# EAGLE design d11toy2ccc (EAGLE 6.6.0)
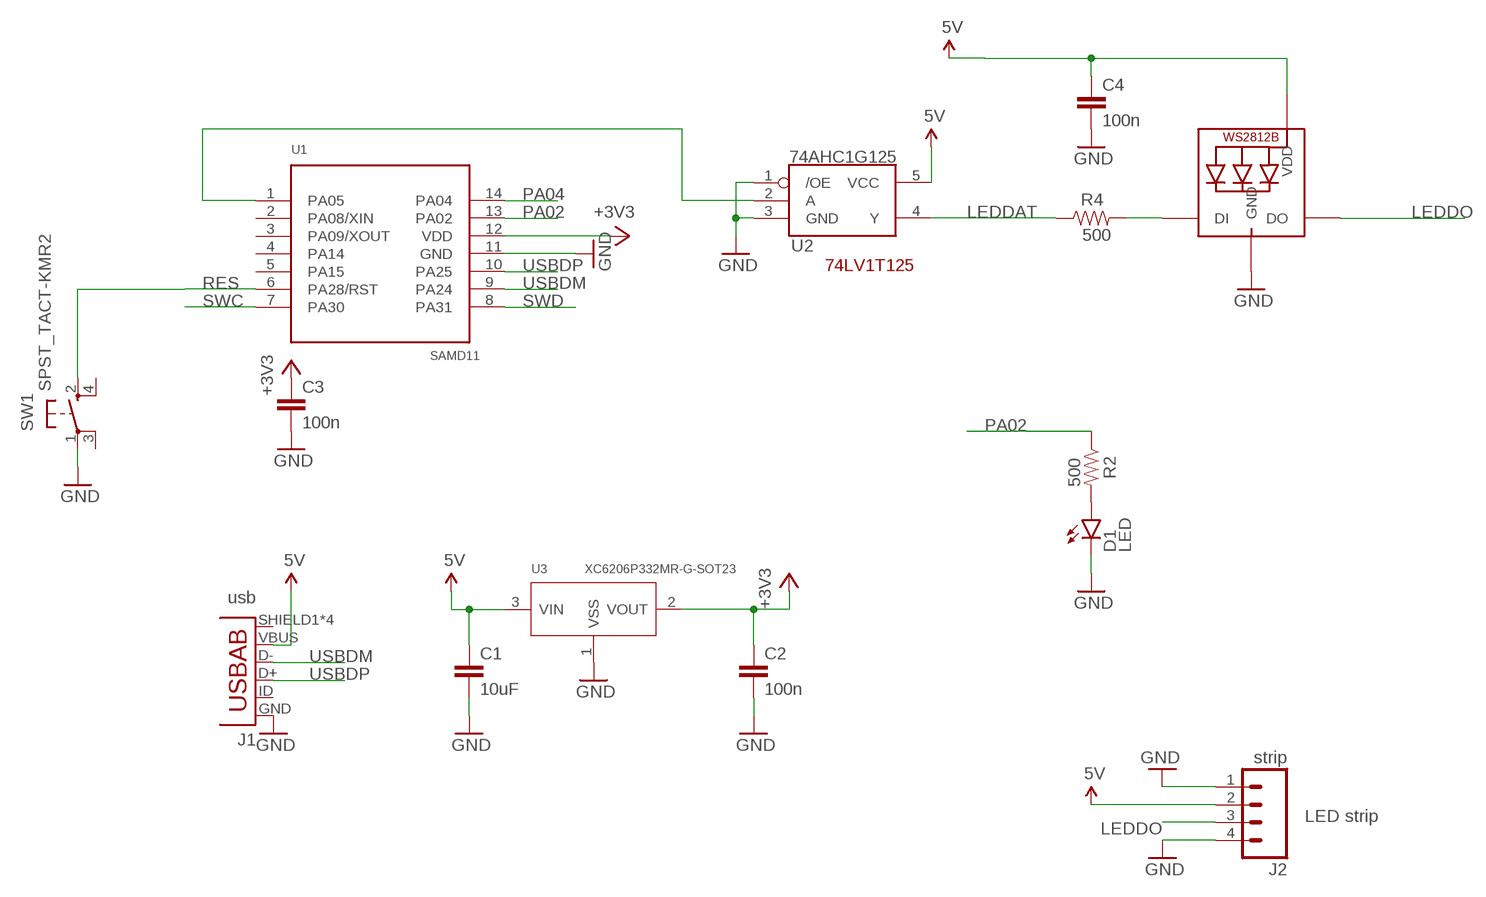
[diagram p0: schematic, sheet 1]

## Parts
C1  10uF  CAP0603-CAP  [0603-CAP]
C2  100n  CAP0603-CAP  [0603-CAP]
C3  100n  CAP0603-CAP  [0603-CAP]
C4  100n  CAP0603-CAP  [0603-CAP]
D1  LED  LED0603  [LED-0603]
J1  usb  USB-AB  [USB-AB-MICRO-SMD]
J2  strip  M04NO_SILK_ALL_ROUND  [1X04_NO_SILK_ALL_ROUND]
LED1  WS2812B5050  [WS2812B]
R2  500  RESISTOR0603-RES  [0603-RES]
R4  500  RESISTOR0603-RES  [0603-RES]
SW1  SPST_TACT-KMR2  [KMR2]
U1  SAMD11  SAMD11C14  [SO14]
U2  74AHC1G125  [SOT23-5]
U3  XC6206P332MR-G-SOT23  PMIC-LDO-XC6206P332MR-G(SOT23)  [SOT-23]

## Nets
5V: C1.1 C4.1 J1.VBUS J2.2 LED1.1-VDD(VDD) U2.5(VCC) U3.3(VIN)
+3V3: C2.1 C3.1 U1.12(VDD) U3.2(VOUT)
GND: C1.2 C2.2 C3.2 C4.2 D1.C J1.GND J2.1 J2.4 LED1.3-GND(GND) SW1.1(P) U1.11(GND) U2.1(/OE) U2.3(GND) U3.1(VSS)
LEDDAT: R4.1 U2.4(Y)
LEDDAT3V3: U1.1(PA05) U2.2(A)
LEDDO: J2.3 LED1.2-DOUT(DO)
N$1: D1.A R2.2
N$5: LED1.4-DIN(DI) R4.2
PA02: R2.1 U1.13(PA02)
PA04: U1.14(PA04)
RES: SW1.2(S) U1.6(PA28/RST)
SWC: U1.7(PA30)
SWD: U1.8(PA31)
USBDM: J1.D- U1.9(PA24)
USBDP: J1.D+ U1.10(PA25)
Unconnected: J1.ID(USBID) J1.SHIELD1(SHIELD) J1.SHIELD2(SHIELD) J1.SHIELD3(SHIELD) J1.SHIELD4(SHIELD) SW1.3(P1) SW1.4(S1) U1.2(PA08/XIN) U1.3(PA09/XOUT) U1.4(PA14) U1.5(PA15)

## Notes on the sheet
- 74LV1T125
- LED strip

## Library data of the parts
C1-C4 = SparkFun-Capacitors:CAP: Capacitor Standard 0603 ceramic capacitor, and 0.1" leaded capacitor.
D1 = SparkFun-LED:LED: LEDs Standard schematic elements and footprints for 5mm, 3mm, 1206, and 0603 sized LEDs. 5mm - Spark Fun Electronics SKU : COM-00529 (and others)
J1 = SparkFun-Connectors:USB-AB: This is a USB AB connector that is compatible with USB OTG. i.e. this connector can serve as a host or device
J2 = SparkFun-Connectors:M04: Header 4 Standard 4-pin 0.1" header. Use with straight break away headers (SKU : PRT-00116), right angle break away headers (PRT-00553), swiss pins (PRT-00743), machine pins (PRT-00117), and female headers (PRT-00115). Molex polarized connector foot print use with SKU : PRT-08231 with associated crimp pins and housings. 1MM SMD Version SKU: PRT-10208; PROD_ID: CONN-09696
LED1 = adafruit:WS2812B
R2 R4 = SparkFun-Passives:RESISTOR: Resistor Basic schematic elements and footprints for 0603, 1206, and PTH resistors.
SW1 = adafruit:SPST_TACT: SMT 6mm switch, EVQQ2 series http://www.ladyada.net/library/eagle
U1 = todstuff:SAMD11C14: ATSAMD11C14A-SS - SAMD11 14-pin SOIC
U2 = SparkFun-DigitalIC:74AHC1G125: Single bus buffer gate with 3-state output; PROD_ID: IC-11920
U3 = Seeed-IC-2016:PMIC-LDO-XC6206P332MR-G(SOT23): 310030099; MPN: XC6206P332MR-G

## Board
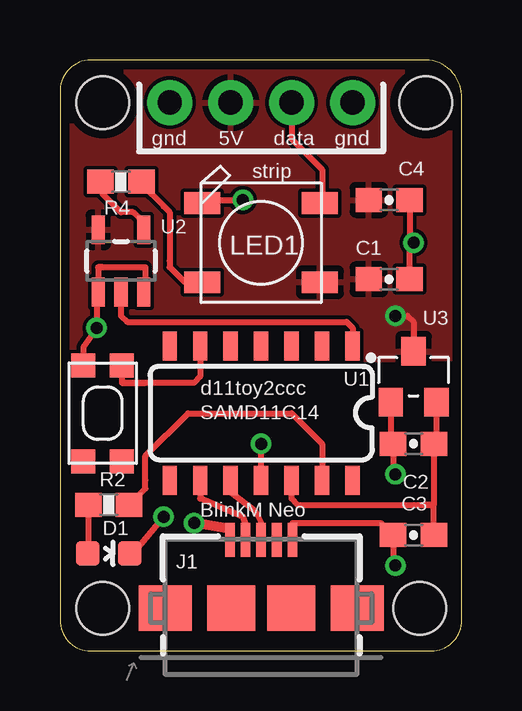
[diagram p1: board, top side]
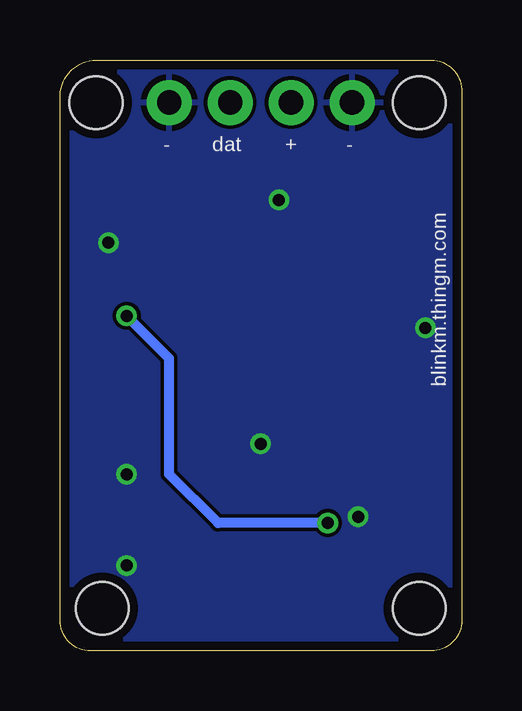
[diagram p2: board, bottom side, seen from below]

Size 16.74 x 24.64 mm. Coordinates in mm from the lower left corner, seen from the top.
Outline: 0,23.29 0,1.27 arc90 1.27,0 15.47,0 arc90 16.74,1.27 16.74,23.04 arc90 15.24,24.64 1.27,24.64 arc90 0,23.29
Copper layers (1*16): Top 0.0356mm / dielectric 1.5011mm / Bottom 0.0356mm
Design rules "LaenPCBOrderTodTent": minimum track width 6mil, minimum drill 13mil, track to track 6mil, track to pad 6mil, pad to pad 6mil, via to via 6mil, smd to smd 6mil, copper to edge 15mil, drill to drill 6mil, minimum pad ring 7mil, minimum via ring 7mil, stop-mask expansion 3mil, vias tented up to drill 20mil, thermal gap 10mil
Holes 2.2 mm at 14.99,1.78 15.24,22.86 1.78,1.78 1.78,22.86

### Footprints (pad centres in the part's own frame; a part is rotated, then mirrored left to right if it is on the bottom)
0603-CAP = smd 1.1 x 1: 1 -0.85,0; 2 0.85,0
LED-0603 = smd 1 x 1: A 0,-0.877; C 0,0.877
USB-AB-MICRO-SMD = smd 1.4 x 0.4: D+ 2.85,0; D- 2.85,0.65; GND 2.85,-1.3; ID 2.85,-0.65; VBUS 2.85,1.3 | smd 1.9 x 2.2: SHIELD1 0,4; SHIELD4 0,-4 | smd 1.9 x 2: SHIELD2 0,1.25; SHIELD3 0,-1.25
1X04_NO_SILK_ALL_ROUND = drill 1.016 pad 1.88: 1 0,0; 2 2.54,0; 3 5.08,0; 4 7.62,0
WS2812B = smd 1.5 x 0.9: 1-VDD 2.45,-1.65; 2-DOUT 2.45,1.65; 3-GND -2.45,1.65; 4-DIN -2.45,-1.65
0603-RES = smd 1.1 x 1: 1 -0.85,0; 2 0.85,0
KMR2 = smd 1 x 1: 1 2,0.8; 2 2,-0.8; 3 -2,0.8; 4 -2,-0.8
SO14 = smd 0.6 x 1.2: 1 -3.81,-2.8; 2 -2.54,-2.8; 3 -1.27,-2.8; 4 0,-2.8; 5 1.27,-2.8; 6 2.54,-2.8; 7 3.81,-2.8; 8 3.81,2.8; 9 2.54,2.8; 10 1.27,2.8; 11 0,2.8; 12 -1.27,2.8; 13 -2.54,2.8; 14 -3.81,2.8
SOT23-5 = smd 0.55 x 1.2: 1 -0.95,-1.3; 2 0,-1.3; 3 0.95,-1.3; 4 0.95,1.3; 5 -0.95,1.3
SOT-23 = smd 1.016 x 1.2: 1 -0.95,-1.06; 2 0.95,-1.06; 3 0,1.06

### Placement (x,y rotation side)
C1  13.72,15.49 0 top
C2  14.73,8.64 180 top
C3  14.73,4.83 180 top
C4  13.72,18.8 0 top
D1  2.03,4.06 270 top
J1  8.38,1.78 90 top
J2  4.57,22.86 0 top
LED1  8.38,17.02 0 top
R2  2.03,6.1 180 top
R4  2.54,19.56 0 top
SW1  1.78,9.91 90 top
U1  8.38,9.91 180 top
U2  2.54,16.26 0 top
U3  14.73,11.43 0 top

### Tracks (layer width: path | path; a pad name or v marks a point on that pad's centre or on a via)
5V  (via drill 0.5)
  Top 0.254: J1.VBUS 7.08,5.08 | v13.97,13.97 14.48,13.97 14.73,13.72 U3.3
  Top 0.406: 7.08,5.08 v5.59,5.33
  Bottom 0.406: v5.59,5.33 10.16,5.33 12.19,7.37 12.19,12.19 v13.97,13.97
  pour Top: -5.08,29.21 17.78,29.21 17.78,0 16.76,-0.25 16.76,12.19 0,11.94 0,0.25 -5.08,0
+3V3
  Top 0.254: U1.12 9.65,6.35 9.91,6.1 15.24,6.1 | U3.2 15.68,8.74 C2.1 15.58,6.1 | 15.24,6.1 15.58,6.1 | C3.1 15.58,6.1 | 15.58,6.1 15.24,6.1
GND  (via drill 0.5)
  Top 0.254: LED1.3-GND 5.84,18.67 5.84,18.8 v7.62,18.8 | U1.11 v8.38,8.64 | C1.2 14.57,16.93 14.65,17.02 v14.73,17.02 14.57,17.02 C4.2 | v13.97,3.56 13.88,3.56 C3.2 13.37,5.33 12.45,5.33 9.68,5.33 J1.GND | U2.3 3.56,15.02 3.56,16 1.78,16 1.59,16 U2.1 1.52,14.89 v1.52,13.46 0.98,12.66 SW1.1 | U3.1 13.78,8.74 C2.2 13.88,7.71 v13.97,7.37 | D1.C 3.05,4.06 v4.32,5.59
  pour Bottom: 17.78,27.94 -1.27,27.94 -1.27,0 17.78,0
LEDDAT
  Top 0.254: U2.4 3.49,17.85 3.05,18.29 2.54,18.29 1.78,19.05 1.78,19.47 R4.1
LEDDAT3V3
  Top 0.254: U2.2 2.54,13.97 2.79,13.72 11.94,13.72 12.19,13.46 U1.1
LEDDO
  Top 0.254: J2.3 9.65,21.34 10.92,20.07 10.92,18.76 LED1.2-DOUT
N$1
  Top 0.254: R2.2 1.18,4.09 D1.A
N$5
  Top 0.254: 5.68,15.15 LED1.4-DIN 5.21,15.37 5.08,15.49 4.57,16 4.57,16.26 4.57,18.29 4.32,18.54 3.39,19.47 R4.2
PA02
  Top 0.254: U1.13 10.92,8.64 9.65,9.91 5.33,9.91 3.56,8.13 3.56,7.11 3.56,6.77 R2.1
RES
  Top 0.254: U1.6 5.84,11.43 5.59,11.18 3.56,11.18 | 3.56,11.18 2.58,11.18 | 2.58,11.18 3.56,11.18 | SW1.2 2.58,11.18 | 2.58,11.18 3.56,11.18
USBDM
  Top 0.254: U1.9 5.84,6.86 5.84,6.35 7.62,5.59 7.73,5.22 J1.D-
USBDP
  Top 0.254: J1.D+ 8.38,5.33 8.13,5.84 7.11,6.6 U1.10

### Text on the board
tPlace: gnd | 5V | data | gnd | strip | d11toy2ccc | SAMD11C14 | BlinkM Neo
bPlace: - | + | dat | - | blinkm.thingm.com